# Altium schematic sheet 13 - User Interface.SchDoc
size B; CompanyName: Microchip Technology Inc.; Organization: Microchip Technology; Address1: 2355 West Chandler Blvd.; Address2: Chandler, AZ  85224; Address4: USA; SheetNumber: 14; SheetTotal: 15; SheetTitle: User Interface; Time: Time
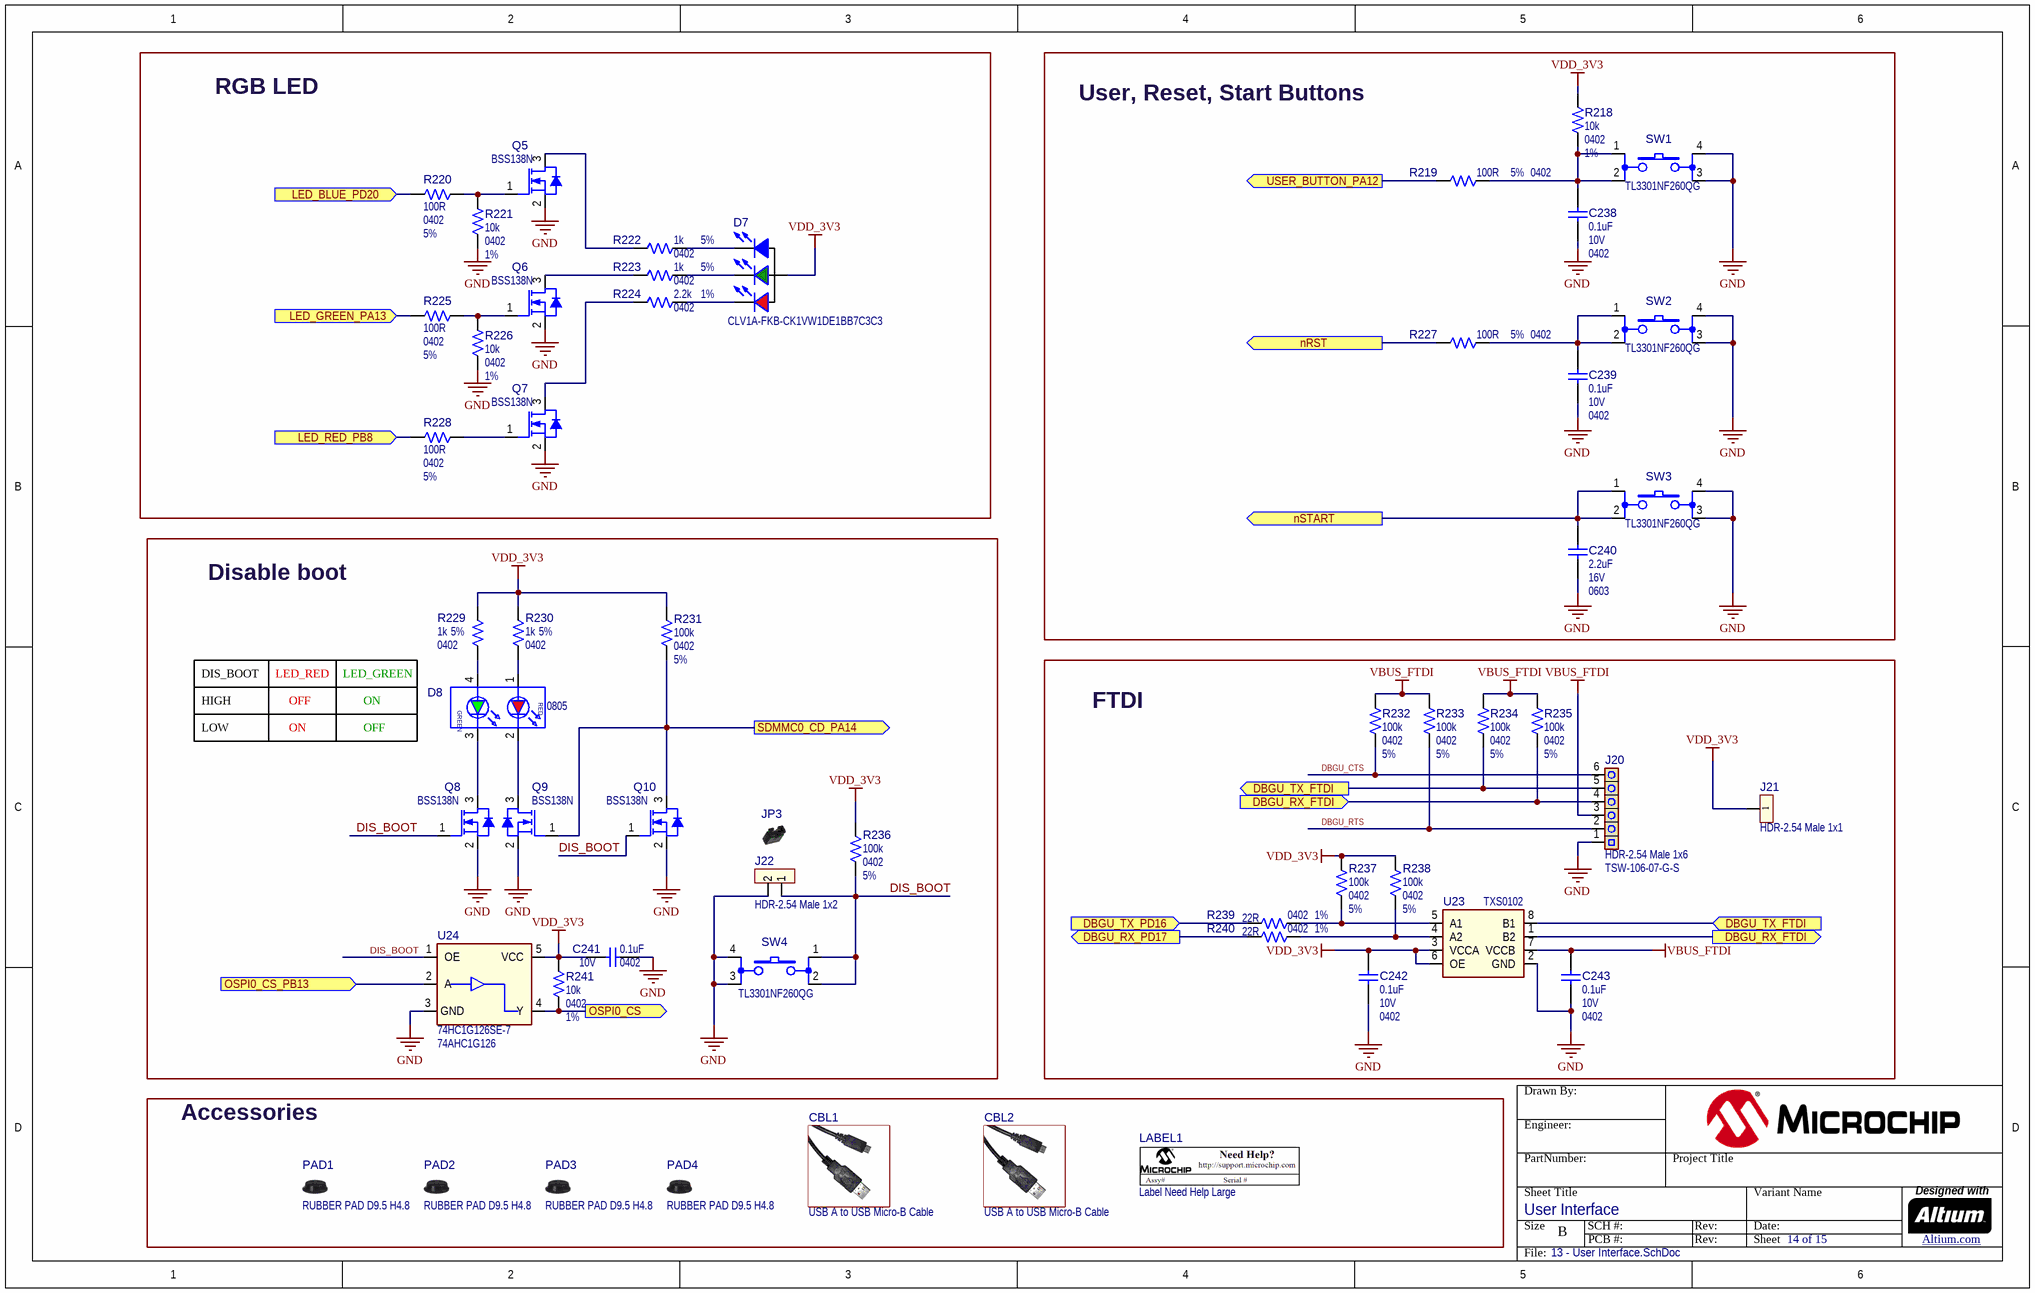
[diagram p0: 13 - User Interface.SchDoc]

## Parts
?  (no value)  (graphical)
C238  value 0.1uF  Voltage: 10V  Package: 0402  [CAP_C_0402]  (hidden comment: Capacitor NP)
C239  value 0.1uF  Voltage: 10V  Package: 0402  [CAP_C_0402]  (hidden comment: Capacitor NP)
C240  value 2.2uF  Voltage: 16V  Package: 0603  [CAP_C_0603]  (hidden comment: Capacitor NP)
C241  value 0.1uF  Voltage: 10V  Package: 0402  [CAP_C_0402]  (hidden comment: Capacitor NP)
C242  value 0.1uF  Voltage: 10V  Package: 0402  [CAP_C_0402]  (hidden comment: Capacitor NP)
C243  value 0.1uF  Voltage: 10V  Package: 0402  [CAP_C_0402]  (hidden comment: Capacitor NP)
CBL1  USB A to USB Micro-B Cable  (mechanical)
CBL2  USB A to USB Micro-B Cable  (mechanical)
D7  Manufacturer Part Number 1: CLV1A-FKB-CK1VW1DE1BB7C3C3  [PLCC-4_CLV1A-FKB]  (hidden comment: LED_RGB_CLV1A)
D8  Package: 0805  [LED_DUAL_SMD_2x1.25mm]  (hidden comment: LED DUAL 4 pin)
J20  value HDR-2.54 Male 1x6  Manufacturer Part Number 3: TSW-106-07-G-S  [HDR_M_2.54_1x6]  (hidden comment: Header 1x6)
J21  value HDR-2.54 Male 1x1  [HDR_M_2.54_1x1]  (hidden comment: Header 1x1)
J22  value HDR-2.54 Male 1x2  [HDR_M_2.54_1x2]  (hidden comment: Header 1x2)
JP3  Jumper Mechanical  [Jumper_Mechanical]  (value not drawn)  (mechanical)
LABEL1  value Label Need Help Large  [LABEL_Need_Help_Large]  (hidden comment: LABEL_Need_Help_Large)
PAD1  value RUBBER PAD D9.5 H4.8  [BUMP_ ESSENTRA_RBS-35_CYLINDRICAL_CLEAR_D9.50H4.8]  (hidden comment: Rubber Pad Cylindrical)
PAD2  value RUBBER PAD D9.5 H4.8  [BUMP_ ESSENTRA_RBS-35_CYLINDRICAL_CLEAR_D9.50H4.8]  (hidden comment: Rubber Pad Cylindrical)
PAD3  value RUBBER PAD D9.5 H4.8  [BUMP_ ESSENTRA_RBS-35_CYLINDRICAL_CLEAR_D9.50H4.8]  (hidden comment: Rubber Pad Cylindrical)
PAD4  value RUBBER PAD D9.5 H4.8  [BUMP_ ESSENTRA_RBS-35_CYLINDRICAL_CLEAR_D9.50H4.8]  (hidden comment: Rubber Pad Cylindrical)
Q5  value BSS138N  [SOT-23-3]  (hidden comment: Transistor MOS-N GSD)
Q6  value BSS138N  [SOT-23-3]  (hidden comment: Transistor MOS-N GSD)
Q7  value BSS138N  [SOT-23-3]  (hidden comment: Transistor MOS-N GSD)
Q8  value BSS138N  [SOT-23-3]  (hidden comment: Transistor MOS-N GSD)
Q9  value BSS138N  [SOT-23-3]  (hidden comment: Transistor MOS-N GSD)
Q10  value BSS138N  [SOT-23-3]  (hidden comment: Transistor MOS-N GSD)
R218  value 10k  Package: 0402  Tolerance: 1%  [RES_C_0402]  (hidden comment: Resistor)
R219  value 100R  Package: 0402  Tolerance: 5%  [RES_C_0402]  (hidden comment: Resistor)
R220  value 100R  Package: 0402  Tolerance: 5%  [RES_C_0402]  (hidden comment: Resistor)
R221  value 10k  Package: 0402  Tolerance: 1%  [RES_C_0402]  (hidden comment: Resistor)
R222  value 1k  Package: 0402  Tolerance: 5%  [RES_C_0402]  (hidden comment: Resistor)
R223  value 1k  Package: 0402  Tolerance: 5%  [RES_C_0402]  (hidden comment: Resistor)
R224  value 2.2k  Package: 0402  Tolerance: 1%  [RES_C_0402]  (hidden comment: Resistor)
R225  value 100R  Package: 0402  Tolerance: 5%  [RES_C_0402]  (hidden comment: Resistor)
R226  value 10k  Package: 0402  Tolerance: 1%  [RES_C_0402]  (hidden comment: Resistor)
R227  value 100R  Package: 0402  Tolerance: 5%  [RES_C_0402]  (hidden comment: Resistor)
R228  value 100R  Package: 0402  Tolerance: 5%  [RES_C_0402]  (hidden comment: Resistor)
R229  value 1k  Package: 0402  Tolerance: 5%  [RES_C_0402]  (hidden comment: Resistor)
R230  value 1k  Package: 0402  Tolerance: 5%  [RES_C_0402]  (hidden comment: Resistor)
R231  value 100k  Package: 0402  Tolerance: 5%  [RES_C_0402]  (hidden comment: Resistor)
R232  value 100k  Package: 0402  Tolerance: 5%  [RES_C_0402]  (hidden comment: Resistor)
R233  value 100k  Package: 0402  Tolerance: 5%  [RES_C_0402]  (hidden comment: Resistor)
R234  value 100k  Package: 0402  Tolerance: 5%  [RES_C_0402]  (hidden comment: Resistor)
R235  value 100k  Package: 0402  Tolerance: 5%  [RES_C_0402]  (hidden comment: Resistor)
R236  value 100k  Package: 0402  Tolerance: 5%  [RES_C_0402]  (hidden comment: Resistor)
R237  value 100k  Package: 0402  Tolerance: 5%  [RES_C_0402]  (hidden comment: Resistor)
R238  value 100k  Package: 0402  Tolerance: 5%  [RES_C_0402]  (hidden comment: Resistor)
R239  value 22R  Package: 0402  Tolerance: 1%  [RES_C_0402]  (hidden comment: Resistor)
R240  value 22R  Package: 0402  Tolerance: 1%  [RES_C_0402]  (hidden comment: Resistor)
R241  value 10k  Package: 0402  Tolerance: 1%  [RES_C_0402]  (hidden comment: Resistor)
SW1  Manufacturer Part Number 2: TL3301NF260QG  [SW_SMD_6mmX6mm_TL3301]  (hidden comment: Switch 4 Pin)
SW2  Manufacturer Part Number 2: TL3301NF260QG  [SW_SMD_6mmX6mm_TL3301]  (hidden comment: Switch 4 Pin)
SW3  Manufacturer Part Number 2: TL3301NF260QG  [SW_SMD_6mmX6mm_TL3301]  (hidden comment: Switch 4 Pin)
SW4  Manufacturer Part Number 2: TL3301NF260QG  [SW_SMD_6mmX6mm_TL3301]  (hidden comment: Switch 4 Pin)
U23  TXS0102  [US-8]
U24  74HC1G126SE-7  value 74AHC1G126  [SC-70-5]

## Blocks framed on the sheet
RGB LED: D7 Q5-Q7 R220-R226 R228
User, Reset, Start Buttons: C238-C240 R218 R219 R227 SW1-SW3
Disable boot: C241 D8 J22 JP3 Q8-Q10 R229-R231 R236 R241 SW4 U24
FTDI: C242 C243 J20 J21 R232-R235 R237-R240 U23
Accessories: CBL1 CBL2 LABEL1 PAD1-PAD4

## Ports
DBGU_RX_FTDI (in), DBGU_RX_FTDI (out), DBGU_RX_PD17 (out), DBGU_TX_FTDI (in), DBGU_TX_FTDI (out), DBGU_TX_PD16 (in), LED_BLUE_PD20 (in), LED_GREEN_PA13 (in), LED_RED_PB8 (in), nRST (out), nSTART (out), OSPI0_CS (out), OSPI0_CS_PB13 (in), SDMMC0_CD_PA14 (out), USER_BUTTON_PA12 (out)

## Nets
GND: C238.2 C239.2 C240.1 C241.1 C242.1 C243.1 J20.1 J22.2 Q5.2(S) Q6.2(S) Q7.2(S) Q8.2(S) Q9.2(S) Q10.2(S) R221.2 R226.2 SW1.3 SW1.4 SW2.3 SW2.4 SW3.3 SW3.4 SW4.3 SW4.4 U23.2(GND) U24.3(GND)
VBUS_FTDI: C243.2 J20.3 R232.1 R233.1 R234.2 R235.2 U23.7(VCCB)
VDD_3V3: C241.2 C242.2 D7.2(A) J21.1 R218.1 R229.1 R230.1 R231.2 R236.2 R237.2 R238.2 R241.1 U23.3(VCCA) U23.6(OE) U24.5(VCC)
DBGU_CTS: J20.6 R232.2
DBGU_RTS: J20.2 R233.2
DBGU_RX_FTDI: J20.4 R235.1 U23.1(B2) ; port DBGU_RX_FTDI
DBGU_RX_PD17: R240.1 ; port DBGU_RX_PD17
DBGU_TX_FTDI: J20.5 R234.1 U23.8(B1) ; port DBGU_TX_FTDI
DBGU_TX_PD16: R239.1 ; port DBGU_TX_PD16
DIS_BOOT: J22.1 Q8.1(G) Q10.1(G) R236.1 SW4.1 SW4.2 U24.1(OE)
LED_BLUE_PD20: R220.1 ; port LED_BLUE_PD20
LED_GREEN_PA13: R225.1 ; port LED_GREEN_PA13
LED_RED_PB8: R228.1 ; port LED_RED_PB8
nRST: R227.1 ; port nRST
nSTART: C240.2 SW3.1 SW3.2 ; port nSTART
OSPI0_CS: R241.2 U24.4(Y) ; port OSPI0_CS
OSPI0_CS_PB13: U24.2(A) ; port OSPI0_CS_PB13
SDMMC0_CD_PA14: Q9.1(G) Q10.3(D) R231.1 ; port SDMMC0_CD_PA14
USER_BUTTON_PA12: R219.1 ; port USER_BUTTON_PA12
NetC238_1: C238.1 R218.2 R219.2 SW1.1 SW1.2
NetC239_1: C239.1 R227.2 SW2.1 SW2.2
NetD7_1: D7.1(Kr) R224.2
NetD7_3: D7.3(Kb) R222.2
NetD7_4: D7.4(Kg) R223.2
NetD8_1: D8.1(A1) R230.2
NetD8_2: D8.2(K1) Q9.3(D)
NetD8_3: D8.3(K2) Q8.3(D)
NetD8_4: D8.4(A2) R229.2
NetQ5_1: Q5.1(G) R220.2 R221.1
NetQ5_3: Q5.3(D) R222.1
NetQ6_1: Q6.1(G) R225.2 R226.1
NetQ6_3: Q6.3(D) R223.1
NetQ7_1: Q7.1(G) R228.2
NetQ7_3: Q7.3(D) R224.1
NetR237_1: R237.1 R239.2 U23.5(A1)
NetR238_1: R238.1 R240.2 U23.4(A2)

## Notes on the sheet
- DIS_BOOT
- HIGH
- LED_RED
- OFF
- LED_GREEN
- ON
- LOW
- Drawn By:
- Engineer:
- PartNumber:
- Project Title
- Sheet Title
- Size
- B
- SCH #:
- PCB #:
- Rev:
- Variant Name
- Date:
- Sheet
- Designed with
- Altium.com <http://go.altium.com/MicrochipLandingPage_Evaluation.html>
- File:
- (in symbol DIODE1110) RED; GREEN

## Library data of the parts
? = Title Block B
C238 C239 C241-C243 = CAP1238: Capacitor; Manufacturer 1: KEMET; Manufacturer Part Number 1: C0402C104K8RACTU; Description_: CAP CER 0.1uF 10V 10% X7R SMD 0402; Dev Tools Status: Production; Tolerance: 10%; Temperature Coeffcient: X7R; Type: Ceramic; Owner: Tad Ahlvers; Populated: YES; MCHP-ID: CAP1238; Revision: 1; Symbol: Capacitor NP; Status: MCL Design; ComponentLink1URL: https://chn-vm-apps.microchip.com/mchprepo/parts/Datasheets/KEM_C1002_X7R_SMD.pdf; ComponentLink1Description: SVN Datasheet; ComponentLink2URL: C:\ALTIUM_WORK\00001_MCHP-CDB\Datasheets\KEM_C1002_X7R_SMD.pdf; ComponentLink2Description: Local Datasheet; ComponentLink3URL: C:\ALTIUM_WORK\00001_MCHP-CDB\Library\LibraryRefs\Capacitor NP.SchLib; ComponentLink3Description: Open Symbol; ComponentLink4URL: C:\ALTIUM_WORK\00001_MCHP-CDB\Library\Footprints\CAP_C_0402.PcbLib; ComponentLink4Description: Open Footprint; ComponentLink5Description: Open Footprint 2; ComponentLink6Description: Open Footprint 3; ComponentLink7Description: Open Footprint 4; Operating Temperature: -55C to +125C; Category: Capacitor; Supplier 1: Digi-Key; Supplier Part Number 1: 399-3520-2-ND; Quantity Override: 1; Manufacturer 2: Samsung; Manufacturer Part Number 2: CL05B104KP5NNNC; Manufacturer 3: Murata Electronics; Manufacturer Part Number 3: GRM155R71A104KA01D; Supplier 2: Digi-Key; Supplier Part Number 2: 1276-1002-2-ND; Supplier 3: Mouser; Supplier Part Number 3: 81-GRM155R71A104KA1D
C240 = CAP0597: Capacitor; Manufacturer 1: TDK; Manufacturer Part Number 1: C1608X5R1C225K; Description_: CAP CER 2.2uF 16V 10% X5R SMD 0603; Dev Tools Status: Production; Tolerance: 10%; Temperature Coeffcient: X5R; Type: Ceramic; Populated: DNP; MCHP-ID: CAP0597; Revision: 2; Symbol: Capacitor NP; Status: MCL Design; ComponentLink1URL: https://chn-vm-apps.microchip.com/mchprepo/parts/Datasheets/general_B11.pdf; ComponentLink1Description: SVN Datasheet; ComponentLink2URL: C:\ALTIUM_WORK\00001_MCHP-CDB\Datasheets\general_B11.pdf; ComponentLink2Description: Local Datasheet; ComponentLink3URL: C:\ALTIUM_WORK\00001_MCHP-CDB\Library\LibraryRefs\Capacitor NP.SchLib; ComponentLink3Description: Open Symbol; ComponentLink4URL: C:\ALTIUM_WORK\00001_MCHP-CDB\Library\Footprints\CAP_C_0603.PcbLib; ComponentLink4Description: Open Footprint; ComponentLink5Description: Open Footprint 2; ComponentLink6Description: Open Footprint 3; ComponentLink7Description: Open Footprint 4; Operating Temperature: -55C to +85C; Category: Capacitor; Supplier 1: Digi-Key; Supplier Part Number 1: 445-5157-1-ND; Quantity Override: 1
CBL1 CBL2 = CAB1028: Manufacturer 1: Qualtek; Manufacturer Part Number 1: 3025030-03; Description_: MECH HW CABLE USB Male A TO USB Male Micro-B 0.91M; Dev Tools Status: Design; Owner: Jose Luis Caceres; Populated: MECH; Revision: 1; MCHP-ID: CAB1028; Value: USB A to USB Micro-B Cable; Symbol: USB A to USB Micro-B Cable; Status: MCL Design; ComponentLink1URL: https://chn-vm-apps.microchip.com/mchprepo/parts/Datasheets/3025030-03.pdf; ComponentLink1Description: SVN Datasheet; ComponentLink2URL: C:\ALTIUM_WORK\00001_MCHP-CDB\Datasheets\3025030-03.pdf; ComponentLink2Description: Local Datasheet; ComponentLink3URL: C:\ALTIUM_WORK\00001_MCHP-CDB\Library\LibraryRefs\USB A to USB Micro-B Cable.SchLib; ComponentLink3Description: Open Symbol; ComponentLink4Description: Open Footprint; ComponentLink5Description: Open Footprint 2; ComponentLink6Description: Open Footprint 3; ComponentLink7Description: Open Footprint 4; Type: Cable; Category: Hardware; Supplier 1: Digi-Key; Supplier Part Number 1: Q966-ND; Quantity Override: 1
D7 = DIODE1214: Manufacturer 1: Cree Inc.; Value: RED, GREEN, BLUE; Description_: DIO LED TRI RED, GREEN, BLUE 2V, 3.2V, 3.2V 20mA, 20mA, 20mA SMD 4-PLCC; Dev Tools Status: Production; Type: LED Tricolor; Forward Current: 20mA, 20mA, 20mA; Power: 130mW, 100mW, 100mW; Reverse Current: 10uA; Reverse Voltage: 5V; Owner: Randolph Sobrepena; Populated: YES; MCHP-ID: DIODE1214; Revision: 2; Symbol: LED_RGB_CLV1A; Status: MCL Design; Package: 4-PLCC; ComponentLink1URL: https://chn-vm-apps.microchip.com/mchprepo/parts/Datasheets/CLV1A-FKB_Rev5; ComponentLink1Description: SVN Datasheet; ComponentLink2URL: C:\ALTIUM_WORK\00001_MCHP-CDB\Datasheets\CLV1A-FKB_Rev5; ComponentLink2Description: Local Datasheet; ComponentLink3URL: C:\ALTIUM_WORK\00001_MCHP-CDB\Library\LibraryRefs\LED_RGB_CLV1A.SchLib; ComponentLink3Description: Open Symbol; ComponentLink4URL: C:\ALTIUM_WORK\00001_MCHP-CDB\Library\Footprints\PLCC-4_CLV1A-FKB.PcbLib; ComponentLink4Description: Open Footprint; ComponentLink5Description: Open Footprint 2; ComponentLink6Description: Open Footprint 3; ComponentLink7Description: Open Footprint 4; Operating Temperature: -40C - +100C; Category: Diode; Supplier 1: Digi-Key; Supplier Part Number 1: CLV1A-FKB-CK1VW1DE1BB7C3C3CT-ND; Quantity Override: 1
D8 = DIODE1110: LED; Manufacturer 1: Kingbright Corp; Manufacturer Part Number 1: APHBM2012SURKCGKC; Value: RED, GREEN; Description_: DIO LED BI RED, GREEN 1.95V, 2.1V 30mA 0805; Dev Tools Status: Production; Type: LED Bicolor; Forward Current: 30mA; Power: 75mW; Reverse Current: 10uA; Owner: Bogdan P (M91398); Populated: Yes; MCHP-ID: DIODE1110; Revision: 0; Symbol: LED DUAL 4 PIN; Status: MCL Design; ComponentLink1URL: https://chn-vm-apps.microchip.com/mchprepo/parts/Datasheets/APHBM2012SURKCGKC.pdf; ComponentLink1Description: SVN Datasheet; ComponentLink2URL: C:\ALTIUM_WORK\00001_MCHP-CDB\Datasheets\APHBM2012SURKCGKC.pdf; ComponentLink2Description: Local Datasheet; ComponentLink3URL: C:\ALTIUM_WORK\00001_MCHP-CDB\Library\LibraryRefs\LED DUAL 4 PIN.SchLib; ComponentLink3Description: Open Symbol; ComponentLink4URL: C:\ALTIUM_WORK\00001_MCHP-CDB\Library\Footprints\LED_DUAL_SMD_2x1.25mm.PcbLib; ComponentLink4Description: Open Footprint; ComponentLink5Description: Open Footprint 2; ComponentLink6Description: Open Footprint 3; ComponentLink7Description: Open Footprint 4; Operating Temperature: -40C to +85C; Category: Diode; Supplier 1: Digi-Key; Supplier Part Number 1: 754-1093-1-ND; Quantity Override: 1
J20 = CON1106: Manufacturer 1: FCI; Manufacturer Part Number 1: 68000-106HLF; Description_: CON HDR-2.54 Male 1x6 Gold 5.84MH TH VERT; Dev Tools Status: Production; Owner: Bogdan P (M91398); Populated: Yes; MCHP-ID: CON1106; Revision: 0; Symbol: Header 1x6; Status: MCL Design; ComponentLink1URL: https://chn-vm-apps.microchip.com/mchprepo/parts/Datasheets/68000.pdf; ComponentLink1Description: SVN Datasheet; ComponentLink2URL: C:\ALTIUM_WORK\00001_MCHP-CDB\Datasheets\68000.pdf; ComponentLink2Description: Local Datasheet; ComponentLink3URL: C:\ALTIUM_WORK\00001_MCHP-CDB\Library\LibraryRefs\Header 1x6.SchLib; ComponentLink3Description: Open Symbol; ComponentLink4URL: C:\ALTIUM_WORK\00001_MCHP-CDB\Library\Footprints\HDR_M_2.54_1x6.PcbLib; ComponentLink4Description: Open Footprint; ComponentLink5Description: Open Footprint 2; ComponentLink6Description: Open Footprint 3; ComponentLink7Description: Open Footprint 4; Type: Header 2.54mm; Category: Connector; Manufacturer 2: FCI; Manufacturer Part Number 2: 68001-106HLF; Manufacturer 3: Samtec Inc; Manufacturer 4: Nextron; Manufacturer Part Number 4: R-211-0611-0021-400; Supplier 1: Digi-Key; Supplier Part Number 1: 609-3249-ND; Supplier 2: Digi-Key; Supplier Part Number 2: 609-3272-ND; Supplier 3: Digi-Key; Supplier Part Number 3: SAM1029-06-ND; Supplier 4: Raynen; Supplier Part Number 4: CONN00260B01M; Quantity Override: 1
J21 = CON1102: CON HDR-2.54 Male 1x1 Gold 5.97MH TH VERT; Manufacturer 1: TE Connectivity; Manufacturer Part Number 1: 5-146280-1; Description_: CON HDR-2.54 Male 1x1 Gold 5.84MH TH VERT; Dev Tools Status: Production; Owner: Bogdan P (M91398); Populated: YES; MCHP-ID: CON1102; Revision: 0; Symbol: Header 1x1; Status: MCL Design; ComponentLink1Description: SVN Datasheet; ComponentLink2Description: Local Datasheet; ComponentLink3URL: C:\ALTIUM_WORK\00001_MCHP-CDB\Library\LibraryRefs\Header 1x1.SchLib; ComponentLink3Description: Open Symbol; ComponentLink4URL: C:\ALTIUM_WORK\00001_MCHP-CDB\Library\Footprints\HDR_M_2.54_1x1.PcbLib; ComponentLink4Description: Open Footprint; ComponentLink5Description: Open Footprint 2; ComponentLink6Description: Open Footprint 3; ComponentLink7Description: Open Footprint 4; Type: Header 2.54mm; Category: Connector; Quantity Override: 1; ComponentLink1URL: https://chn-vm-apps.microchip.com/mchprepo/parts/Datasheets/ENG_CD_103239_H2.pdf; ComponentLink2URL: C:\ALTIUM_WORK\00001_MCHP-CDB\Datasheets\ENG_CD_103239_H2.pdf; Manufacturer 2: Nextron; Manufacturer Part Number 2: 211-0111-0021-400; Manufacturer 3: TE Connectivity; Manufacturer Part Number 3: 5-146868-1; Supplier 1: Digi-Key; Supplier Part Number 1: A107006-ND; Supplier 2: Raynen; Supplier Part Number 2: 211-0111-0021-400; Supplier 3: Digi-Key; Supplier Part Number 3: A105161CT-ND
J22 = CON1312: Manufacturer 1: Sullins Connector Solutions; Manufacturer Part Number 1: PREC002SAAN-RC; Description_: CON HDR-2.54 Male 1x2 Tin 5.84MH TH VERT; Dev Tools Status: Production; Owner: Randolph Sobrepena; Populated: YES; MCHP-ID: CON1312; Revision: 2; Symbol: Header 1x2; Status: MCL Design; ComponentLink1URL: https://chn-vm-apps.microchip.com/mchprepo/parts/Datasheets/z RzCzzzSzzN-RC, ST,11635-B.pdf; ComponentLink1Description: SVN Datasheet; ComponentLink2URL: C:\ALTIUM_WORK\00001_MCHP-CDB\Datasheets\z RzCzzzSzzN-RC, ST,11635-B.pdf; ComponentLink2Description: Local Datasheet; ComponentLink3URL: C:\ALTIUM_WORK\00001_MCHP-CDB\Library\LibraryRefs\Header 1x2.SchLib; ComponentLink3Description: Open Symbol; ComponentLink4URL: C:\ALTIUM_WORK\00001_MCHP-CDB\Library\Footprints\HDR_M_2.54_1x2.PcbLib; ComponentLink4Description: Open Footprint; ComponentLink5Description: Open Footprint 2; ComponentLink6Description: Open Footprint 3; ComponentLink7Description: Open Footprint 4; Type: Header 2.54mm; Category: Connector; Manufacturer 2: SHENZHEN JUNHAO ENGINEERING; Manufacturer Part Number 2: R-211-0211-0021-000; Supplier 1: Digi-Key; Supplier Part Number 1: S1012EC-02-ND; Supplier 2: Raynen; Supplier Part Number 2: CONN00252C01M; Quantity Override: 1
JP3 = MECH0174: Manufacturer 1: Wurth Electronics Inc.; Manufacturer Part Number 1: 60900213421; Value: Shunt 2.54mm 1x2; Description_: MECH HW JUMPER 2.54mm 1x2 GOLD; Dev Tools Status: Production; Owner: Narasimha Murthy; Populated: MECH; MCHP-ID: MECH0174; Revision: 1; Symbol: Jumper Mechanical; Status: MCL Design; ComponentLink1URL: https://chn-vm-apps.microchip.com/mchprepo/parts/Datasheets/60900213421.pdf; ComponentLink1Description: SVN Datasheet; ComponentLink2URL: C:\ALTIUM_WORK\00001_MCHP-CDB\Datasheets\60900213421.pdf; ComponentLink2Description: Local Datasheet; ComponentLink3URL: C:\ALTIUM_WORK\00001_MCHP-CDB\Library\LibraryRefs\Jumper Mechanical.SchLib; ComponentLink3Description: Open Symbol; ComponentLink4URL: C:\ALTIUM_WORK\00001_MCHP-CDB\Library\Footprints\Jumper_Mechanical.PcbLib; ComponentLink4Description: Open Footprint; ComponentLink5Description: Open Footprint 2; ComponentLink6Description: Open Footprint 3; ComponentLink7Description: Open Footprint 4; Type: Jumper; Category: Hardware; Supplier 1: Digi-Key; Supplier Part Number 1: 732-2678-ND; Quantity Override: 1
LABEL1 = 08-00126: Description_: LABEL, NEED HELP WITH ASSY/SERIAL; Dev Tools Status: Production; Populated: MECH; MCHP-ID: 08-00126; Revision: 6; Symbol: LABEL_Need_Help_Large; Status: MCL Design; ComponentLink1URL: https://chn-vm-apps.microchip.com/mchprepo/parts/Datasheets/08-00126R6.pdf; ComponentLink1Description: SVN Datasheet; ComponentLink2URL: C:\ALTIUM_WORK\00001_MCHP-CDB\Datasheets\08-00126R6.pdf; ComponentLink2Description: Local Datasheet; ComponentLink3URL: C:\ALTIUM_WORK\00001_MCHP-CDB\Library\LibraryRefs\LABEL_Need_Help_Large.SchLib; ComponentLink3Description: Open Symbol; ComponentLink4URL: C:\ALTIUM_WORK\00001_MCHP-CDB\Library\Footprints\LABEL_Need_Help_Large.PcbLib; ComponentLink4Description: Open Footprint; ComponentLink5Description: Open Footprint 2; ComponentLink6Description: Open Footprint 3; ComponentLink7Description: Open Footprint 4; Type: Large; Category: Label; Quantity Override: 1
PAD1-PAD4 = MECH0185: Manufacturer 1: Essentra Components; Manufacturer Part Number 1: RBS-35; Description_: MECH HW RUBBER PAD Cylindrical, 0.374" x 0.189" Clear; Dev Tools Status: Design; Owner: Sam Charles; Populated: MECH; MCHP-ID: MECH0185; Revision: A; Symbol: Rubber Pad Cylindrical; Status: MCL Design; ComponentLink1URL: https://chn-vm-apps.microchip.com/mchprepo/parts/Datasheets/RBS.pdf; ComponentLink1Description: SVN Datasheet; ComponentLink2URL: C:\ALTIUM_WORK\00001_MCHP-CDB\Datasheets\RBS.pdf; ComponentLink2Description: Local Datasheet; ComponentLink3URL: C:\ALTIUM_WORK\00001_MCHP-CDB\Library\LibraryRefs\Rubber Pad Cylindrical.SchLib; ComponentLink3Description: Open Symbol; ComponentLink4URL: C:\ALTIUM_WORK\00001_MCHP-CDB\Library\Footprints\BUMP_ ESSENTRA_RBS-35_CYLINDRICAL_CLEAR_D9.50H4.8.PcbLib; ComponentLink4Description: Open Footprint; ComponentLink5Description: Open Footprint 2; ComponentLink6Description: Open Footprint 3; ComponentLink7Description: Open Footprint 4; Type: Rubber Pad; Category: Hardware; Supplier 1: Digi-Key; Supplier Part Number 1: RPC1620-ND; Quantity Override: 1
Q5-Q10 = TRA1223: Transistor MOS; Manufacturer 1: Infineon Technologies; Manufacturer Part Number 1: BSS138NH6327XTSA2; Description_: TRANS FET N-CH BSS138N 60V 230mA SOT23-3; Dev Tools Status: Production; Type: FET; Current: 230mA; Drain to Source Voltage: 60V; Gate to Source Voltage: 20V; Power: 0.36W; Owner: Dragos Danaila; Populated: YES; MCHP-ID: TRA1223; Revision: 1; Symbol: Transistor MOS-N GSD; Status: MCL Design; Package: SOT23-3; ComponentLink1URL: https://chn-vm-apps.microchip.com/mchprepo/parts/Datasheets/Infineon-BSS138N-DS-v02_86-en.pdf; ComponentLink1Description: SVN Datasheet; ComponentLink2URL: C:\ALTIUM_WORK\00001_MCHP-CDB\Datasheets\Infineon-BSS138N-DS-v02_86-en.pdf; ComponentLink2Description: Local Datasheet; ComponentLink3URL: C:\ALTIUM_WORK\00001_MCHP-CDB\Library\LibraryRefs\Transistor MOS-N GSD.SchLib; ComponentLink3Description: Open Symbol; ComponentLink4URL: C:\ALTIUM_WORK\00001_MCHP-CDB\Library\Footprints\SOT-23-3.PcbLib; ComponentLink4Description: Open Footprint; ComponentLink5Description: Open Footprint 2; ComponentLink6Description: Open Footprint 3; ComponentLink7Description: Open Footprint 4; Operating Temperature: -55C to +150C; Category: Transistor; Voltage: 60V; Supplier 1: Digi-Key; Supplier Part Number 1: BSS138NH6327XTSA2CT-ND; Quantity Override: 1
R218 R221 R226 R241 = RSMT1019: Manufacturer 1: Panasonic; Manufacturer Part Number 1: ERJ-2RKF1002X; Description_: RES TKF 10k 1% 1/10W SMD 0402; Dev Tools Status: Production; Voltage: 50V; Temperature Coeffcient: 100ppm/C; Power: 1/10W; Populated: Yes; Owner: Brent Lanphear; MCHP-ID: RSMT1019; Revision: 2; Symbol: Resistor; Status: MCL Design; ComponentLink1URL: https://chn-vm-apps.microchip.com/mchprepo/parts/Datasheets/AOA0000CE2.pdf; ComponentLink1Description: SVN Datasheet; ComponentLink2URL: C:\ALTIUM_WORK\00001_MCHP-CDB\Datasheets\AOA0000CE2.pdf; ComponentLink2Description: Local Datasheet; ComponentLink3URL: C:\ALTIUM_WORK\00001_MCHP-CDB\Library\LibraryRefs\Resistor.SchLib; ComponentLink3Description: Open Symbol; ComponentLink4URL: C:\ALTIUM_WORK\00001_MCHP-CDB\Library\Footprints\RES_C_0402.PcbLib; ComponentLink4Description: Open Footprint; ComponentLink5Description: Open Footprint 2; ComponentLink6Description: Open Footprint 3; ComponentLink7Description: Open Footprint 4; Operating Temperature: -55C to +155C; Category: Resistor; Type: RES SMD; Composition: TKF; Supplier 1: Digi-Key; Supplier Part Number 1: P10.0KLCT-ND; Quantity Override: 1
R219 R220 R225 R227 R228 = RES2692: Manufacturer 1: Bourns Inc.; Manufacturer Part Number 1: CR0402AJW-101GAS; Description_: RES TKF 100R 5% 1/10W SMD 0402; Dev Tools Status: Design; Voltage: 50V; Temperature Coeffcient: 200ppm/C; Power: 1/16W; Owner: Dragos Danaila; Populated: YES; MCHP-ID: RES2692; Revision: 1; Symbol: Resistor; Status: MCL Design; ComponentLink1URL: https://chn-vm-apps.microchip.com/mchprepo/parts/Datasheets/crxxxxa-as.pdf; ComponentLink1Description: SVN Datasheet; ComponentLink2URL: C:\ALTIUM_WORK\00001_MCHP-CDB\Datasheets\crxxxxa-as.pdf; ComponentLink2Description: Local Datasheet; ComponentLink3URL: C:\ALTIUM_WORK\00001_MCHP-CDB\Library\LibraryRefs\Resistor.SchLib; ComponentLink3Description: Open Symbol; ComponentLink4URL: C:\ALTIUM_WORK\00001_MCHP-CDB\Library\Footprints\RES_C_0402.PcbLib; ComponentLink4Description: Open Footprint; ComponentLink5Description: Open Footprint 2; ComponentLink6Description: Open Footprint 3; ComponentLink7Description: Open Footprint 4; Operating Temperature: -55C to +155C; Category: Resistor; Type: RES SMD; Composition: TKF; Supplier 1: Digikey; Supplier Part Number 1: CR0402AJW-101GASTR-ND; Quantity Override: 1
R222 R223 R229 R230 = RSMT0316: Manufacturer 1: Panasonic; Manufacturer Part Number 1: ERJ-2GEJ102X; Description_: RES TKF 1k 5% 1/16W SMD 0402; Dev Tools Status: Production; Voltage: 50V; Temperature Coeffcient: 200ppm/C; Power: 1/16W; Owner: Tad Ahlvers; Populated: YES; MCHP-ID: RSMT0316; Revision: 1; Symbol: Resistor; Status: MCL Design; ComponentLink1URL: https://chn-vm-apps.microchip.com/mchprepo/parts/Datasheets/AOA0000CE1.pdf; ComponentLink1Description: SVN Datasheet; ComponentLink2URL: C:\ALTIUM_WORK\00001_MCHP-CDB\Datasheets\AOA0000CE1.pdf; ComponentLink2Description: Local Datasheet; ComponentLink3URL: C:\ALTIUM_WORK\00001_MCHP-CDB\Library\LibraryRefs\Resistor.SchLib; ComponentLink3Description: Open Symbol; ComponentLink4URL: C:\ALTIUM_WORK\00001_MCHP-CDB\Library\Footprints\RES_C_0402.PcbLib; ComponentLink4Description: Open Footprint; ComponentLink5Description: Open Footprint 2; ComponentLink6Description: Open Footprint 3; ComponentLink7Description: Open Footprint 4; Operating Temperature: -55C to +155C; Category: Resistor; Type: RES SMD; Composition: TKF; Supplier 1: Digi-Key; Supplier Part Number 1: P1.0KJCT-ND; Quantity Override: 1
R224 = RES1023: Manufacturer 1: Panasonic; Manufacturer Part Number 1: ERJ-2RKF2201X; Description_: RES TKF 2.2k 1% 1/10W SMD 0402; Dev Tools Status: Production; Voltage: 50V; Temperature Coeffcient: 100ppm/C; Power: 1/10W; Owner: Tad Ahlvers; Populated: YES; MCHP-ID: RES1023; Revision: 1; Symbol: Resistor; Status: MCL Design; ComponentLink1URL: https://chn-vm-apps.microchip.com/mchprepo/parts/Datasheets/AOA0000CE2.pdf; ComponentLink1Description: SVN Datasheet; ComponentLink2URL: C:\ALTIUM_WORK\00001_MCHP-CDB\Datasheets\AOA0000CE2.pdf; ComponentLink2Description: Local Datasheet; ComponentLink3URL: C:\ALTIUM_WORK\00001_MCHP-CDB\Library\LibraryRefs\Resistor.SchLib; ComponentLink3Description: Open Symbol; ComponentLink4URL: C:\ALTIUM_WORK\00001_MCHP-CDB\Library\Footprints\RES_C_0402.PcbLib; ComponentLink4Description: Open Footprint; ComponentLink5Description: Open Footprint 2; ComponentLink6Description: Open Footprint 3; ComponentLink7Description: Open Footprint 4; Operating Temperature: -55C to +155C; Category: Resistor; Type: RES SMD; Composition: TKF; Supplier 1: Digi-Key; Supplier Part Number 1: P2.20KLTR-ND; Quantity Override: 1
R231 R234-R238 = RSMT0737: Manufacturer 1: Panasonic; Manufacturer Part Number 1: ERJ-2GEJ104X; Description_: RES TKF 100k 5% 1/10W SMD 0402; Dev Tools Status: Production; Temperature Coeffcient: 200ppm/C; Power: 1/10W; Populated: Yes; Voltage: 50V; MCHP-ID: RSMT0737; Revision: 1; Symbol: Resistor; Status: MCL Design; ComponentLink1URL: https://chn-vm-apps.microchip.com/mchprepo/parts/Datasheets/AOA0000CE1.pdf; ComponentLink1Description: SVN Datasheet; ComponentLink2URL: C:\ALTIUM_WORK\00001_MCHP-CDB\Datasheets\AOA0000CE1.pdf; ComponentLink2Description: Local Datasheet; ComponentLink3URL: C:\ALTIUM_WORK\00001_MCHP-CDB\Library\LibraryRefs\Resistor.SchLib; ComponentLink3Description: Open Symbol; ComponentLink4URL: C:\ALTIUM_WORK\00001_MCHP-CDB\Library\Footprints\RES_C_0402.PcbLib; ComponentLink4Description: Open Footprint; ComponentLink5Description: Open Footprint 2; ComponentLink6Description: Open Footprint 3; ComponentLink7Description: Open Footprint 4; Category: Resistor; Type: RES SMD; Composition: TKF; Supplier 1: Digi-Key; Supplier Part Number 1: P100KJCT-ND; Quantity Override: 1; Operating Temperature: -55C to +155C; Manufacturer 2: Stackpole Electronics Inc; Manufacturer Part Number 2: RMCF0402JT100K; Supplier 2: Digi-Key; Supplier Part Number 2: RMCF0402JT100KCT-ND
R232 R233 = RSMT0737: Manufacturer 1: Panasonic; Manufacturer Part Number 1: ERJ-2GEJ104X; Description_: RES TKF 100k 5% 1/10W SMD 0402; Dev Tools Status: Production; Temperature Coeffcient: 200ppm/C; Power: 1/10W; Populated: DNP; Voltage: 50V; MCHP-ID: RSMT0737; Revision: 1; Symbol: Resistor; Status: MCL Design; ComponentLink1URL: https://chn-vm-apps.microchip.com/mchprepo/parts/Datasheets/AOA0000CE1.pdf; ComponentLink1Description: SVN Datasheet; ComponentLink2URL: C:\ALTIUM_WORK\00001_MCHP-CDB\Datasheets\AOA0000CE1.pdf; ComponentLink2Description: Local Datasheet; ComponentLink3URL: C:\ALTIUM_WORK\00001_MCHP-CDB\Library\LibraryRefs\Resistor.SchLib; ComponentLink3Description: Open Symbol; ComponentLink4URL: C:\ALTIUM_WORK\00001_MCHP-CDB\Library\Footprints\RES_C_0402.PcbLib; ComponentLink4Description: Open Footprint; ComponentLink5Description: Open Footprint 2; ComponentLink6Description: Open Footprint 3; ComponentLink7Description: Open Footprint 4; Category: Resistor; Type: RES SMD; Composition: TKF; Supplier 1: Digi-Key; Supplier Part Number 1: P100KJCT-ND; Quantity Override: 1; Operating Temperature: -55C to +155C; Manufacturer 2: Stackpole Electronics Inc; Manufacturer Part Number 2: RMCF0402JT100K; Supplier 2: Digi-Key; Supplier Part Number 2: RMCF0402JT100KCT-ND
R239 R240 = RES1474: Manufacturer 1: Panasonic Electronic Components; Manufacturer Part Number 1: ERJ-2RKF22R0X; Description_: RES TKF 22R 1% 1/20W SMD 0402; Dev Tools Status: Production; Temperature Coeffcient: 100ppm/C; Circuit Type: Isolated; Power: 1/10W; Owner: Mike Ragsdale; Populated: YES; MCHP-ID: RES1474; Revision: 1; Symbol: Resistor; Status: MCL Design; ComponentLink1Description: SVN Datasheet; ComponentLink2Description: Local Datasheet; ComponentLink3URL: C:\ALTIUM_WORK\00001_MCHP-CDB\Library\LibraryRefs\Resistor.SchLib; ComponentLink3Description: Open Symbol; ComponentLink4URL: C:\ALTIUM_WORK\00001_MCHP-CDB\Library\Footprints\RES_C_0402.PcbLib; ComponentLink4Description: Open Footprint; ComponentLink5Description: Open Footprint 2; ComponentLink6Description: Open Footprint 3; ComponentLink7Description: Open Footprint 4; Operating Temperature: -55C to +155C; Category: Resistor; Type: RES SMD; Composition: TKF; Supplier 1: Digi-Key; Supplier Part Number 1: P22.0LCT-ND; Quantity Override: 1
SW1-SW4 = SWITCH0003: Switch; Manufacturer 1: E-Switch; Manufacturer Part Number 1: TL3301NF260QG/TR; Value: TACT SPST; Description_: SWITCH TACT SPST 12V 50mA TL3301NF160QG/TR SMD; Dev Tools Status: Production; Voltage: 12V; Current: 50mA; Populated: Yes; MCHP-ID: SWITCH0003; Revision: 2; Symbol: Switch 4 Pin; Status: MCL Design; ComponentLink1URL: https://chn-vm-apps.microchip.com/mchprepo/parts/Datasheets/TL3301.pdf; ComponentLink1Description: SVN Datasheet; ComponentLink2URL: C:\ALTIUM_WORK\00001_MCHP-CDB\Datasheets\TL3301.pdf; ComponentLink2Description: Local Datasheet; ComponentLink3URL: C:\ALTIUM_WORK\00001_MCHP-CDB\Library\LibraryRefs\Switch 4 Pin.SchLib; ComponentLink3Description: Open Symbol; ComponentLink4URL: C:\ALTIUM_WORK\00001_MCHP-CDB\Library\Footprints\SW_SMD_6mmX6mm_TL3301.PcbLib; ComponentLink4Description: Open Footprint; ComponentLink5Description: Open Footprint 2; ComponentLink6Description: Open Footprint 3; ComponentLink7Description: Open Footprint 4; Operating Temperature: -20C to +70C; Category: Switch; Type: Tactile; Manufacturer 2: E-Switch; Manufacturer 3: E-Switch; Manufacturer Part Number 3: TL3301NF160QG/TR; Manufacturer 4: OMRON; Manufacturer Part Number 4: B3S-1000P; Manufacturer 5: OMRON; Manufacturer Part Number 5: B3S-1000; Manufacturer 6: OMRON; Manufacturer Part Number 6: B3S-1002P; Manufacturer 7: OMRON; Manufacturer Part Number 7: B3S-1002; Manufacturer 8: Switech Electronics Co. Ltd; Manufacturer Part Number 8: TS2A-043C-G9; Supplier 1: Digi-Key; Supplier Part Number 1: EG1868CT-ND; Supplier 2: Digi-Key; Supplier Part Number 2: EG1868TR-ND; Supplier 3: Digi-Key; Supplier Part Number 3: EG1867CT-ND; Supplier 4: Digi-Key; Supplier Part Number 4: SW836CT-ND; Supplier 5: Digi-Key; Supplier Part Number 5: SW415-ND; Supplier 6: Digi-Key; Supplier Part Number 6: SW837CT-ND; Supplier 7: Digi-Key; Supplier Part Number 7: SW416-ND; Supplier 8: Raynen; Supplier Part Number 8: SWIT00025C01; Quantity Override: 1
U23 = IC1128: Level Shifter; Manufacturer 1: Texas Instruments; Manufacturer Part Number 1: TXS0102DCUR; MCHP-ID: IC1128; Description_: IC TRANSCEIVER TXS0102 US-8; Dev Tools Status: Production; Owner: Bogdan P (M91398); Populated: Yes; Value: TXS0102; Revision: 0; Symbol: TXS0102; Status: MCL Design; Package: US-8; ComponentLink1URL: https://chn-vm-apps.microchip.com/mchprepo/parts/Datasheets/txs0102.pdf; ComponentLink1Description: SVN Datasheet; ComponentLink2URL: C:\ALTIUM_WORK\00001_MCHP-CDB\Datasheets\txs0102.pdf; ComponentLink2Description: Local Datasheet; ComponentLink3URL: C:\ALTIUM_WORK\00001_MCHP-CDB\Library\LibraryRefs\TXS0102.SchLib; ComponentLink3Description: Open Symbol; ComponentLink4URL: C:\ALTIUM_WORK\00001_MCHP-CDB\Library\Footprints\US-8.PcbLib; ComponentLink4Description: Open Footprint; ComponentLink5Description: Open Footprint 2; ComponentLink6Description: Open Footprint 3; ComponentLink7Description: Open Footprint 4; Operating Temperature: -40C to +85C; Type: Transceiver; Category: IC; Supplier 1: Digi-Key; Supplier Part Number 1: 296-21931-1-ND; Quantity Override: 1
U24 = IC1252: Single  Non-Inverting 3-State  buffer; Manufacturer 1: Diodes Incorporated; Manufacturer Part Number 1: 74AHC1G126SE-7; MCHP-ID: IC1252; Description_: IC BUFFER 74AHC1G126SE-7 SINGLE SC-70-5; Dev Tools Status: Design; Owner: Ed Kennedy; Populated: YES; Revision: A; Symbol: 74HC1G126 SC-70-5; Status: MCL Design; Package: SC-70-5; ComponentLink1URL: https://chn-vm-apps.microchip.com/mchprepo/parts/Datasheets/74AHC1G126.pdf; ComponentLink1Description: SVN Datasheet; ComponentLink2URL: C:\ALTIUM_WORK\00001_MCHP-CDB\Datasheets\74AHC1G126.pdf; ComponentLink2Description: Local Datasheet; ComponentLink3URL: C:\ALTIUM_WORK\00001_MCHP-CDB\Library\LibraryRefs\74HC1G126 SC-70-5.SchLib; ComponentLink3Description: Open Symbol; ComponentLink4URL: C:\ALTIUM_WORK\00001_MCHP-CDB\Library\Footprints\SC-70-5.PcbLib; ComponentLink4Description: Open Footprint; ComponentLink5Description: Open Footprint 2; ComponentLink6Description: Open Footprint 3; ComponentLink7Description: Open Footprint 4; Operating Temperature: -40°C ~ 125°C; Type: Buffer; Category: IC; Supplier 1: Mouser; Supplier Part Number 1: 621-74AHC1G126SE-7; Quantity Override: 1